# EAGLE design USB_Iso (EAGLE 9.5.1)
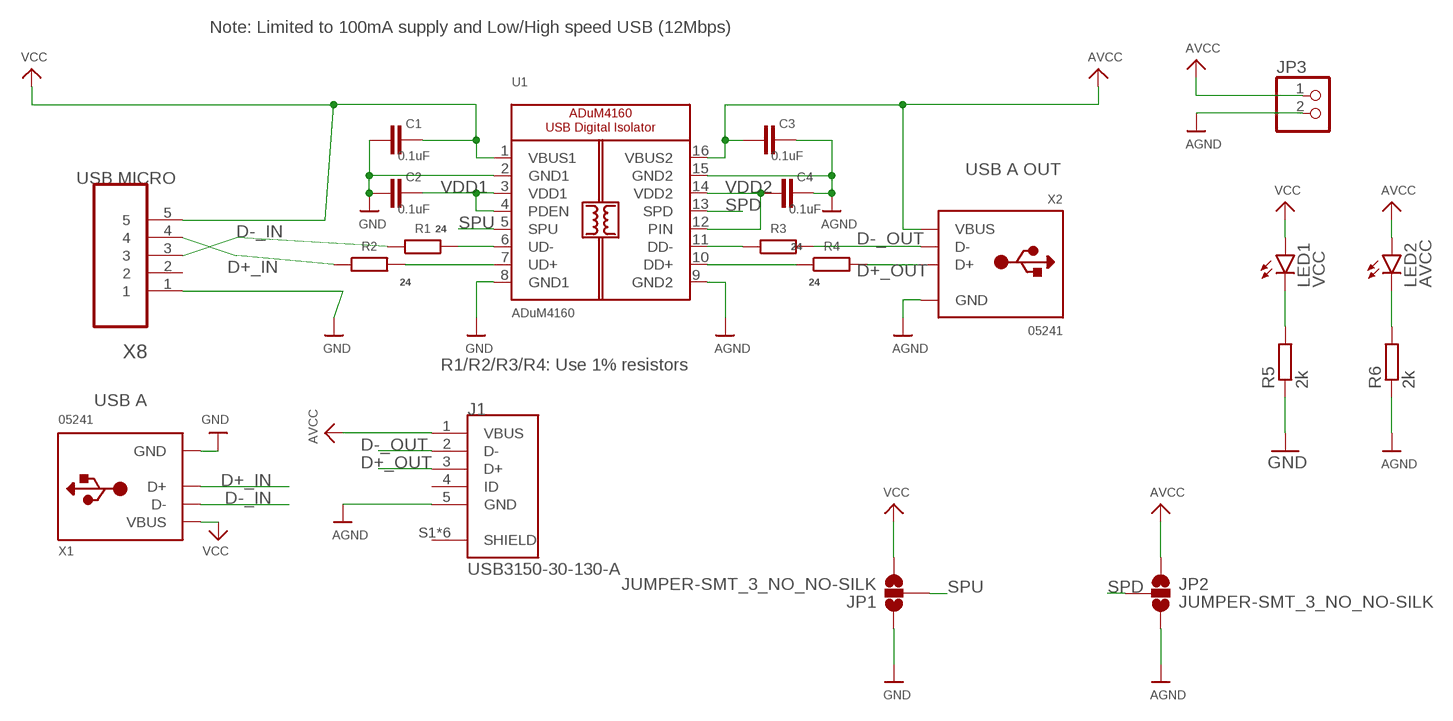
[diagram p0: schematic, sheet 1]

## Parts
C1  0.1uF  C-EUC0603  [C0603]
C2  0.1uF  C-EUC0603  [C0603]
C3  0.1uF  C-EUC0603  [C0603]
C4  0.1uF  C-EUC0603  [C0603]
J1  USB3150-30-130-A  [GCT_USB3150-30-130-A]
JP1  JUMPER-SMT_3_NO_NO-SILK  [SMT-JUMPER_3_NO_NO-SILK]
JP2  JUMPER-SMT_3_NO_NO-SILK  [SMT-JUMPER_3_NO_NO-SILK]
JP3  PINHD-1X2  [1X02]
LED1  VCC  LEDCHIP-LED0805  [CHIP-LED0805]
LED2  AVCC  LEDCHIP-LED0805  [CHIP-LED0805]
R1  24  R-EU_R0603  [R0603]
R2  24  R-EU_R0603  [R0603]
R3  24  R-EU_R0603  [R0603]
R4  24  R-EU_R0603  [R0603]
R5  2k  R-EU_R0805  [R0805]
R6  2k  R-EU_R0805  [R0805]
U1  ADuM4160  ADUM4160  [SOIC16WIDE]
X1  05241  USB_TYPEAPTHFML  [USB_HOST-PTH]
X2  05241  USB_TYPEAPTHFML  [USB_HOST-PTH]
X8  47346-0001  [MOLEX_47346-0001]

## Nets
AGND: C3.1 C4.1 J1.5(GND) JP2.3 JP3.2 R6.1 U1.9(GND2) U1.15(GND2) X2.GND
AVCC: C3.2 J1.1(VBUS) JP2.1 JP3.1 LED2.A U1.16(VBUS2) X2.VBUS
D+_IN: R2.1 X1.D+ X8.4
D+_OUT: J1.3(D+) R4.2 X2.D+
D-_IN: R1.1 X1.D- X8.3
D-_OUT: J1.2(D-) R3.2 X2.D-
GND: C1.2 C2.2 JP1.1 R5.1 U1.2(GND1) U1.8(GND1) X1.GND X8.1
N$1: LED1.C R5.2
N$2: R2.2 U1.7(UD+)
N$3: R1.2 U1.6(UD-)
N$4: LED2.C R6.2
N$5: R4.1 U1.10(DD+)
N$8: R3.1 U1.11(DD-)
SPD: JP2.2 U1.13(SPD)
SPU: JP1.2 U1.5(SPU)
VCC: C1.1 JP1.3 LED1.A U1.1(VBUS1) X1.VBUS X8.5
VDD1: C2.1 U1.3(VDD1) U1.4(PDEN)
VDD2: C4.2 U1.12(PIN) U1.14(VDD2)
Unconnected: J1.4(ID) J1.S1(SHIELD) J1.S2(SHIELD) J1.S3(SHIELD) J1.S4(SHIELD) J1.S5(SHIELD) J1.S6(SHIELD) X8.2

## Notes on the sheet
- Note: Limited to 100mA supply and Low/High speed USB (12Mbps)
- USB A OUT
- USB MICRO
- R1/R2/R3/R4: Use 1% resistors
- USB A

## Library data of the parts
C1-C4 = rcl:C-EU: CAPACITOR, European symbol; SPICEPREFIX: C
J1 = USB3150-30-130-A:USB3150-30-130-A: Vertical Through Hole Type B Micro USB Plug w/ Shell Stakes and Pegs; AVAILABILITY: Unavailable; DESCRIPTION: Vertical Through Hole Type B Micro USB Plug w/ Shell Stakes and Pegs; MF: Global Connector Technology; MP: USB3150-30-130-A; PACKAGE: None; PRICE: None
JP1 JP2 = SparkFun-Jumpers:JUMPER-SMT_3_NO: Normally open jumper This jumper has three pads in close proximity to each other. Apply solder to close the connection(s).
JP3 = pinhead:PINHD-1X2: PIN HEADER
LED1 LED2 = led:LED: LED OSRAM: - CHIPLED LG R971, LG N971, LY N971, LG Q971, LY Q971, LO R971, LY R971 LH N974, LH R974 LS Q976, LO Q976, LY Q976 LO Q996 - Hyper CHIPLED LW Q18S LB Q993, LB Q99A, LB R99A - SideLED LS A670, LO A670, LY A670, LG A670, LP A670 LB A673, LV A673, LT A673, LW A673 LH A674 LY A675 LS A676, LA A676, LO A676, LY A676, LW A676 LS A679, LY A679, LG A679 - Hyper Micro SIDELED® LS Y876, LA Y876, LO Y876, LY Y876 LT Y87S - SmartLED LW L88C, LW L88S LB L89C, LB L89S, LG L890 LS L89K, LO L89K, LY L89K LS L896, LA L896, LO L896, LY L896 - TOPLED LS T670, LO T670, LY T670, LG T670, LP T670 LSG T670, LSP T670, LSY T670, LOP T670, LYG T670 LG T671, LOG T671, LSG T671 LB T673, LV T673, LT T673, LW T673 LH T674 LS T676, LA T676, LO T676, LY T676, LB T676, LH T676, LSB T676, LW T676 LB T67C, LV T67C, LT T67C, LS T67K, LO T67K, LY T67K, LW E67C LS E67B, LA E67B, LO E67B, LY E67B, LB E67C, LV E67C, LT E67C LW T67C LS T679, LY T679, LG T679 LS T770, LO T770, LY T770, LG T770, LP T770 LB T773, LV T773, LT T773, LW T773 LH T774 LS E675, LA E675, LY E675, LS T675 LS T776, LA T776, LO T776, LY T776, LB T776 LHGB T686 LT T68C, LB T68C - Hyper Mini TOPLED® LB M676 - Mini TOPLED Santana® LG M470 LS M47K, LO M47K, LY M47K Source: http://www.osram.convergy.de LUXEON: - LUMILED® LXK2-PW12-R00, LXK2-PW12-S00, LXK2-PW14-U00, LXK2-PW14-V00 LXK2-PM12-R00, LXK2-PM12-S00, LXK2-PM14-U00 LXK2-PE12-Q00, LXK2-PE12-R00, LXK2-PE12-S00, LXK2-PE14-T00, LXK2-PE14-U00 LXK2-PB12-K00, LXK2-PB12-L00, LXK2-PB12-M00, LXK2-PB14-N00, LXK2-PB14-P00, LXK2-PB14-Q00 LXK2-PR12-L00, LXK2-PR12-M00, LXK2-PR14-Q00, LXK2-PR14-R00 LXK2-PD12-Q00, LXK2-PD12-R00, LXK2-PD12-S00 LXK2-PH12-R00, LXK2-PH12-S00 LXK2-PL12-P00, LXK2-PL12-Q00, LXK2-PL12-R00 Source: www.luxeon.com KINGBRIGHT: KA-3528ASYC Source: www.kingbright.com; SPICEPREFIX: L
R1-R6 = rcl:R-EU_: RESISTOR, European symbol; SPICEPREFIX: R
U1 = ADUM:ADUM4160: ADuM4160 Digital USB Isolator
X1 X2 = microbuilder:USB_TYPEA: USB - Type A Connectors Male types stick out and are inserted into a PC or matching females parts (these are the connectors used on USB Memory Sticks, etc.). Female parts are generally used for USB Host and accept a male-type connector. SMT - 4UCON: 10017 PTHFML - Digikey: 609-1045-ND, 4UCon: 05241 PCB - Use 2.0mm thick PCBs with this footprint
X8 = Molex-47346-0001:47346-0001: CONN RCPT 5POS MICRO USB R/A SMD; MPN: 47346-0001; OC_FARNELL: 1568026; OC_NEWARK: 47M0505; PACKAGE: 5 POS MICRO USB R/A; SUPPLIER: MOLEX

## Board
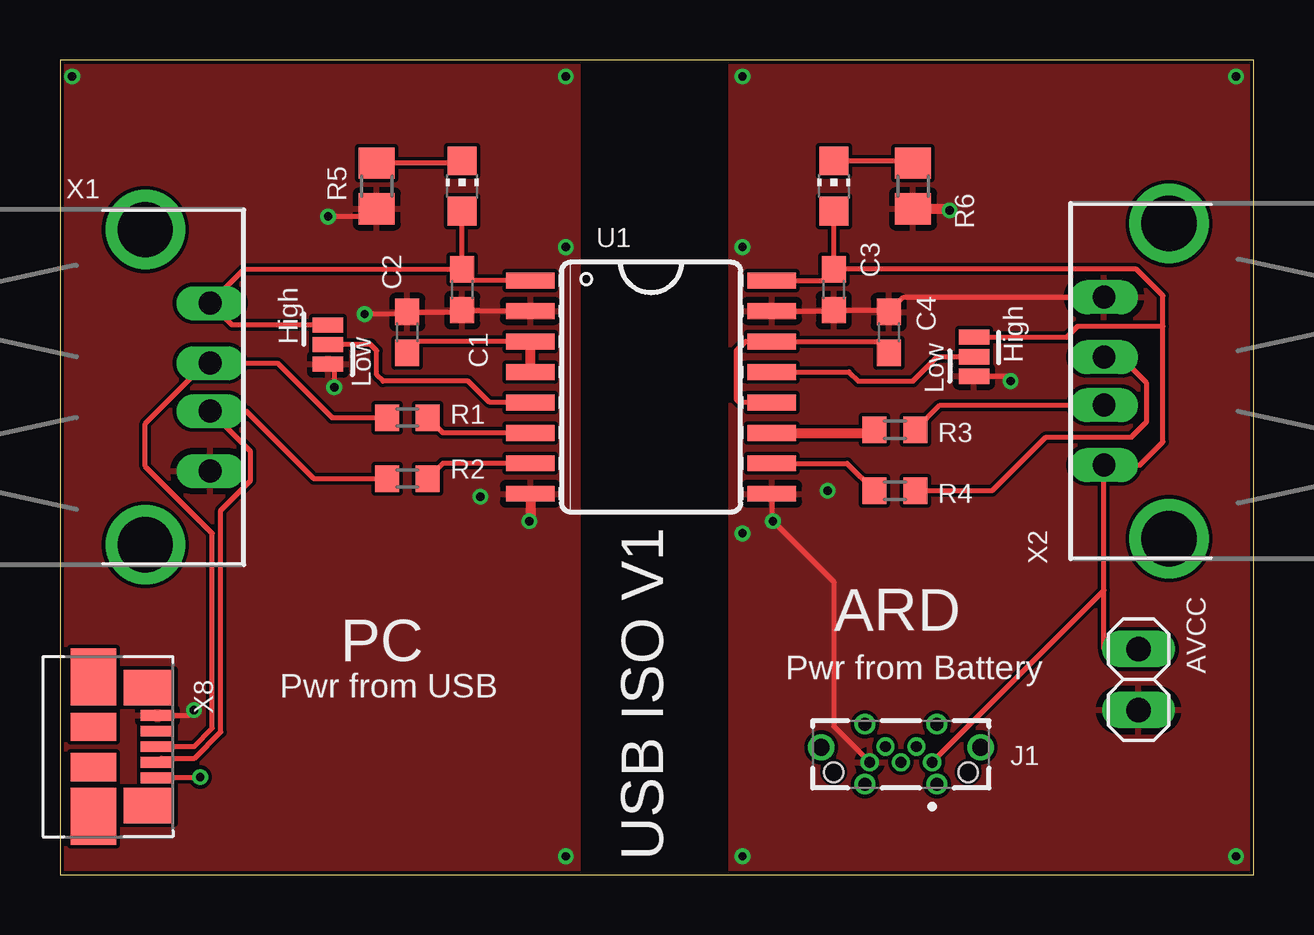
[diagram p1: board, top side]
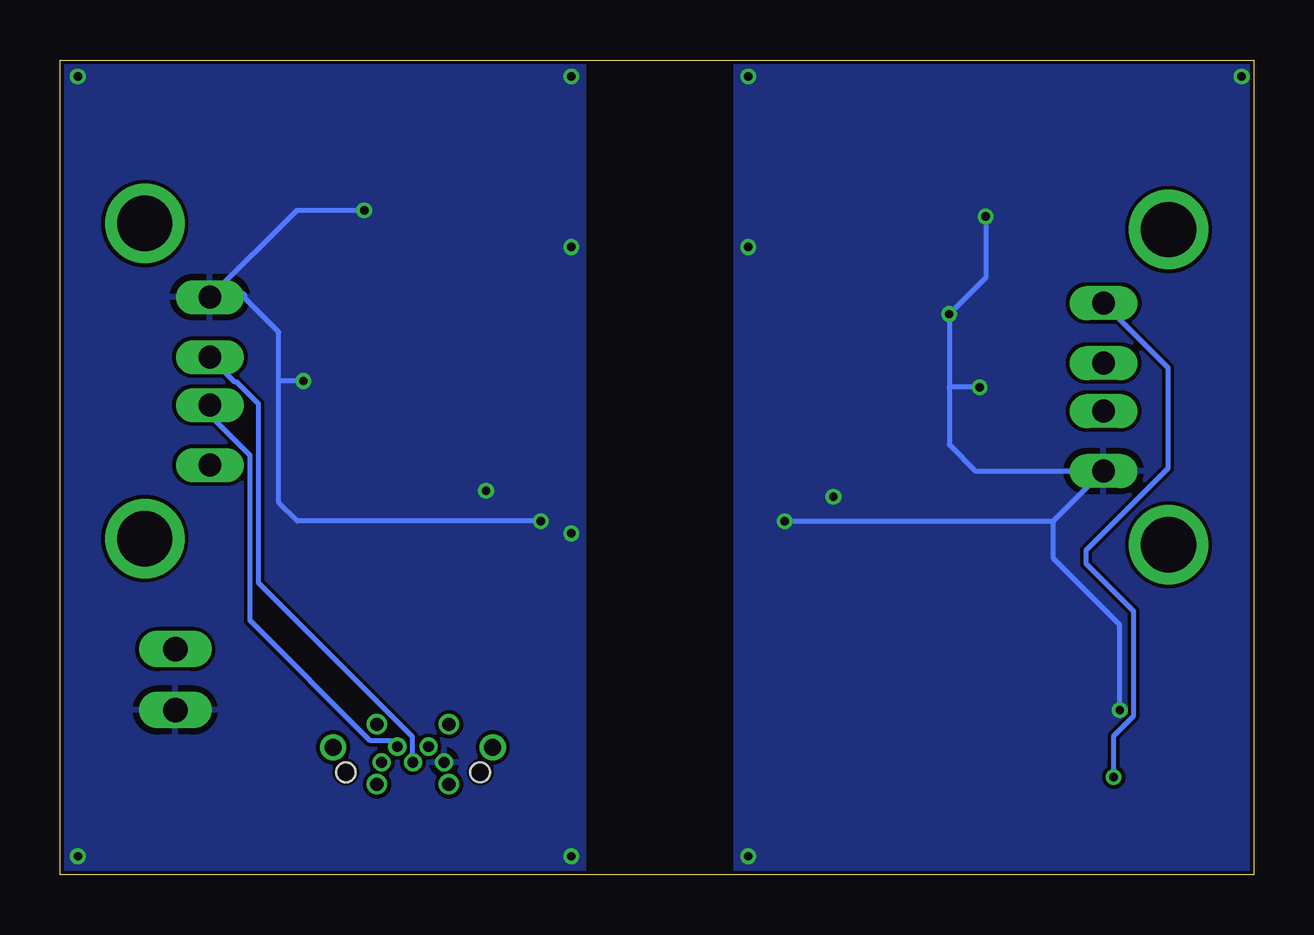
[diagram p2: board, bottom side, seen from below]

Size 49.76 x 33.96 mm. Coordinates in mm from the lower left corner, seen from the top.
Outline: 0,0 49.76,0 49.76,33.96 0,33.96 0,0
Copper layers (1*16): Top 0.035mm / dielectric 1.5mm / Bottom 0.035mm
Design rules "SparkFun-2-layer-PCBWay-LIMIT": minimum track width 6mil, minimum drill 0.3mm, track to track 6mil, track to pad 6mil, pad to pad 6mil, via to via 6mil, smd to smd 6mil, copper to edge 6mil, drill to drill 6mil, minimum pad ring 6mil, minimum via ring 6mil, stop-mask expansion 4mil, vias tented up to drill 25mil, thermal gap 10mil

### Footprints (pad centres in the part's own frame; a part is rotated, then mirrored left to right if it is on the bottom)
C0603 = smd 1.1 x 1: 1 -0.85,0; 2 0.85,0
GCT_USB3150-30-130-A = drill 0.45 pad 0.75: 1 -1.3,0.65; 2 -0.65,0; 3 0,0.65; 4 0.65,0; 5 1.3,0.65 | drill 0.55 pad 0.79: S1 -1.5,1.57; S2 1.5,1.57; S3 -1.5,-0.93; S4 1.5,-0.93 | drill 0.7 pad 1.1: S5 -3.325,0.03; S6 3.325,0.03 | hole 0.8: -2.8,1.07; 2.8,1.07
SMT-JUMPER_3_NO_NO-SILK = smd 0.635 x 1.27: 1 -0.813,0; 2 0,0; 3 0.813,0
1X02 = drill 1.016 long: 1 -1.27,0; 2 1.27,0
CHIP-LED0805 = smd 1.2 x 1.2: A 0,-1.05; C 0,1.05
R0603 = smd 1 x 1.1: 1 -0.85,0; 2 0.85,0
R0805 = smd 1.3 x 1.5: 1 -0.95,0; 2 0.95,0
SOIC16WIDE = smd 0.66 x 2.032: 1 -4.445,-5.029; 2 -3.175,-5.029; 3 -1.905,-5.029; 4 -0.635,-5.029; 5 0.635,-5.029; 6 1.905,-5.029; 7 3.175,-5.029; 8 4.445,-5.029; 9 4.445,5.029; 10 3.175,5.029; 11 1.905,5.029; 12 0.635,5.029; 13 -0.635,5.029; 14 -1.905,5.029; 15 -3.175,5.029; 16 -4.445,5.029
USB_HOST-PTH = drill 0.95 long: D+ 1,6.52; D- -1,6.52; GND 3.5,6.52; VBUS -3.5,6.52 | drill 2.3 pad 2.9: S1 -6.57,3.81; S2 6.57,3.81
MOLEX_47346-0001 = smd 0.45 x 1.38: 1 -1.3,0; 2 -0.65,0; 3 0,0; 4 0.65,0; 5 1.3,0 | smd 1.475 x 2.1: M1 -2.462,-0.36; M2 2.462,-0.36 | smd 2.375 x 1.9: M3 -2.913,-2.66; M6 2.913,-2.66 | smd 1.175 x 1.9: M4 -0.82,-2.66; M5 0.85,-2.66

### Placement (x,y rotation side)
C1  16.76,24.38 270 top
C2  14.48,22.61 90 top
C3  32.26,24.38 90 top
C4  34.54,22.61 270 top
J1  35.05,5.33 180 top
JP1  11.18,22.1 90 top
JP2  38.1,21.59 270 top
JP3  44.96,8.13 270 top
LED1  16.76,28.7 0 top
LED2  32.26,28.7 0 top
R1  14.48,19.05 0 top
R2  14.48,16.51 0 top
R3  34.8,18.54 0 top
R4  34.8,16 0 top
R5  13.21,28.7 90 top
R6  35.56,28.7 90 top
U1  24.64,20.32 270 top
X1  -0.25,20.32 270 top
X2  50.04,20.57 90 top
X8  4.06,5.33 270 top

### Tracks (layer width: path | path; a pad name or v marks a point on that pad's centre or on a via)
AGND  (via drill 0.35)
  Top 0.203: U1.15 32.22,23.5 | C3.1 34.47,23.53 | C4.1 35.16,24.07 X2.GND | U1.9 29.67,14.78 | JP2.3 39.42,20.78 v39.62,20.57 | v29.72,14.73 32.26,12.19 32.26,6.18 J1.5
  Top 0.406: 32.22,23.5 C3.1 | 34.47,23.53 C4.1 | R6.1 37.02,27.75 v37.08,27.69 | 29.67,14.78 v29.72,14.73
  Bottom 0.203: v37.08,27.69 39.91,27.69 X2.GND | v29.72,14.73 39.88,14.73 40.64,15.49 40.64,20.57 | 40.64,20.57 40.64,22.61 42.16,24.13 | v39.62,20.57 40.64,20.57
  Bottom 0.406: 42.16,24.13 43.46,24.13 X2.GND
  other vias: 28.45,33.27 49.02,33.27 32,16 28.45,14.22 28.45,26.16 28.45,0.76 49.02,0.76
  pour Top: 27.94,33.78 27.94,0 49.78,0 49.78,33.78
  pour Bottom: 27.94,33.78 27.94,0 49.53,0 49.53,33.78
AVCC
  Top 0.203: U1.16 31.79,24.77 C3.2 | C3.2 LED2.A | 45.97,22.86 45.97,18.03 45.01,17.07 X2.VBUS 43.52,11.85 | 45.97,22.86 45.97,24.13 44.87,25.23 C3.2 | 45.97,22.86 42.42,22.86 41.96,22.4 JP2.1 | J1.1 43.52,11.85 | JP3.1 43.52,9.4 43.52,11.85
D+_IN
  Top 0.203: R2.1 10.58,16.51 7.77,19.32 X1.D+ 7.95,17.64 7.95,16.42 6.71,15.18 6.71,5.95 5.61,4.86 4.24,4.86 X8.4
D+_OUT
  Top 0.203: R4.2 38.86,16 41.1,18.24 44.66,18.24 45.3,18.88 45.3,20.49 44.2,21.59 43.53,21.59 X2.D+
  Bottom 0.203: J1.3 35.07,4.7 35.07,5.75 41.48,12.16 41.48,19.62 42.41,20.54 42.48,20.54 X2.D+
D-_IN
  Top 0.203: R1.1 11.34,19.05 9.07,21.32 X1.D- 6.08,21.32 3.56,18.8 3.56,17.02 6.35,14.22 6.35,6.1 5.59,5.33 X8.3
D-_OUT
  Top 0.203: R3.2 36.68,19.57 X2.D-
  Bottom 0.203: J1.2 35.95,5.58 36.83,5.58 41.84,10.59 41.84,17.47 43.52,19.15 X2.D-
GND  (via drill 0.35)
  Top 0.203: C2.2 16.69,23.46 | U1.2 16.73,23.5 | 14.39,23.37 v12.7,23.37 | 12.89,27.43 v11.18,27.43 | X8.1 5.36,6.63 v5.59,6.86 | JP1.1 11.43,21.03 v11.43,20.32
  Top 0.406: C1.2 16.73,23.5 16.69,23.46 | C2.2 14.39,23.37 | R5.1 12.89,27.43 | U1.8 19.61,14.78 v19.56,14.73
  Bottom 0.203: 12.7,20.32 v12.7,23.37 11.18,24.89 v11.18,27.43 | 12.7,20.32 12.7,17.92 11.6,16.82 X1.GND 8.35,14.73 | v19.56,14.73 8.35,14.73 | v5.59,6.86 5.59,10.41 8.35,13.18 8.35,14.73 | v11.43,20.32 12.7,20.32
  other vias: 21.08,33.27 21.08,0.76 17.53,15.75 0.51,33.27 21.08,26.16
  pour Top: 0,33.78 21.59,33.78 21.59,0 0,0
  pour Bottom: 0.25,33.78 0.25,0 21.59,0 21.59,33.78
N$1
  Top 0.203: 16.66,29.65 R5.2
  Top 0.406: LED1.C 16.66,29.65
N$2
  Top 0.203: U1.7 15.96,17.14 R2.2
N$3
  Top 0.203: U1.6 15.96,18.41 R1.2
N$4
  Top 0.203: LED2.C 35.46,29.75
  Top 0.406: 35.46,29.75 R6.2
N$5
  Top 0.203: U1.10 32.8,17.14 R4.1
N$8
  Top 0.406: U1.11 33.82,18.41 R3.1
SPD
  Top 0.203: U1.13 32.89,20.95 33.27,20.57 35.56,20.57 36.58,21.59 JP2.2
SPU
  Top 0.203: U1.5 17.91,19.68 17.02,20.57 13.46,20.57 13.21,20.83 13.21,21.84 12.95,22.1 JP1.2
VCC  (via drill 0.35)
  Top 0.203: U1.1 17.23,24.77 C1.1 | C1.1 7.68,25.23 X1.VBUS 7.17,22.91 JP1.3 | C1.1 LED1.A | X8.5 4.09,4.06 v5.84,4.06
  Bottom 0.203: v5.84,4.06 5.84,5.78 5.01,6.62 5.01,10.97 6.99,12.96 6.99,13.53 3.57,16.95 3.57,21.12 X1.VBUS
VDD1
  Top 0.203: U1.3 14.95,22.23 C2.1
  Top 0.406: U1.4 U1.3
VDD2
  Top 0.203: C4.2 34.08,22.23 U1.14 28.57,22.23 28.19,21.84 28.19,19.81 28.32,19.68 U1.12

### Text on the board
tPlace: High | High | Low | Low | USB ISO V1 | ARD | PC | Pwr from Battery | AVCC | Pwr from USB